# Altium schematic sheet TYPE-C FEMALE 16PIN C720628.schdoc
size 124 x 99 mm
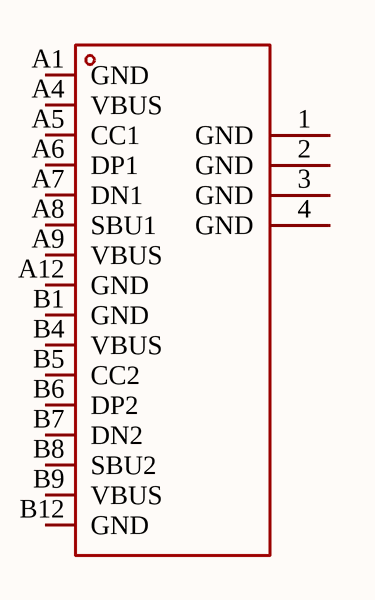
[diagram p0: TYPE-C FEMALE 16PIN C720628.schdoc]

## Parts
USB?  TYPEC-303-ACP16  [USB-C-SMD_TYPEC-303-ACP16]  (value not drawn)

## Nets

Not connected (* = marked no-connect by the designer): USB? 1(GND) 2(GND) 3(GND) 4(GND) A1(GND) A4(VBUS) A5(CC1) A6(DP1) A7(DN1) A8(SBU1) A9(VBUS) A12(GND) B1(GND) B4(VBUS) B5(CC2) B6(DP2) B7(DN2) B8(SBU2) B9(VBUS) B12(GND)

## Library data of the parts
USB? = TYPEC-303-ACP16: Manufacturer: XUNPU(讯普); Add into BOM: yes; Connector Type: Type-C; Gender: 母; Number of Ports: 1; Number of Contacts: 16P; Current Rating - Power (Max): 5A; Soldering Temperature(Max): 260℃; Symbol: TYPEC-303-ACP16; Device: TYPEC-303-ACP16; LCSC Part Name: Type-C 母 立贴; Supplier Part: C720628; Manufacturer Part: TYPEC-303-ACP16; Supplier Footprint: SMD; JLCPCB Part Class: Extended Part; Datasheet: https://atta.szlcsc.com/upload/public/pdf/source/20211130/923863AA03137020414D5B2211B6B11A.pdf; Supplier: LCSC; Convert to PCB: yes; Standard: USB 3.1; Mounting Style: 立贴; Operating Temperature Range: -25℃~+85℃